# EAGLE design board1 (EAGLE 8.7.1)
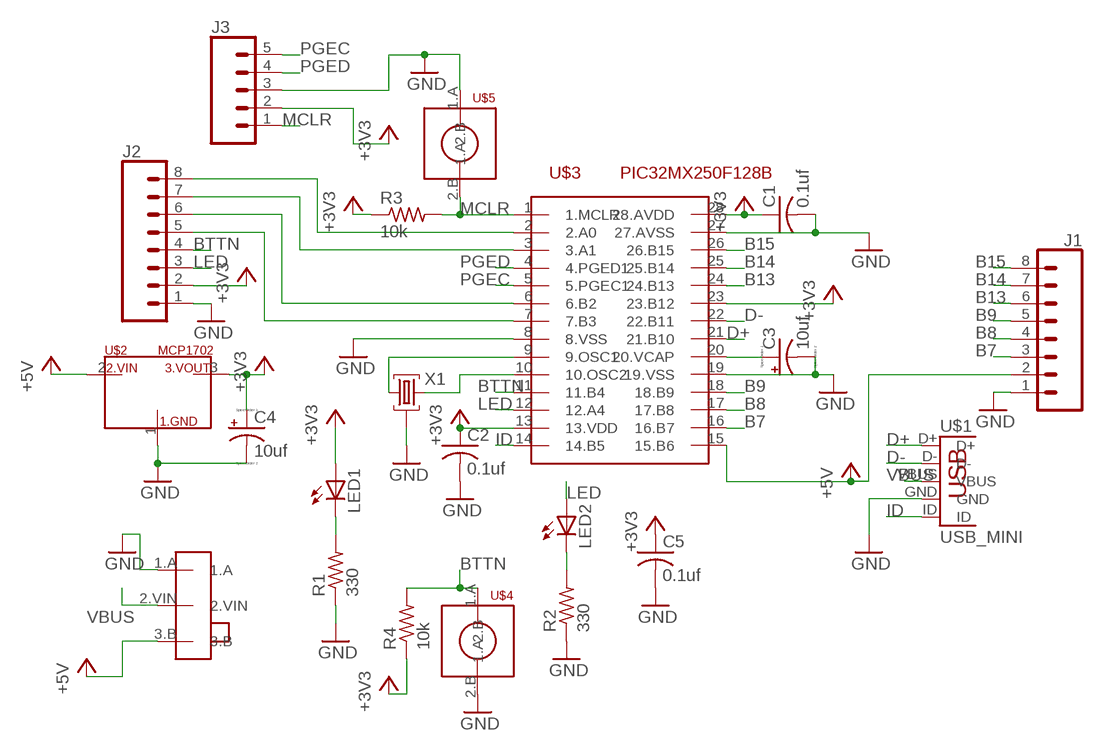
[diagram p0: schematic, sheet 1]

## Parts
C1  0.1uf  C-US025-025X050  [C025-025X050]
C2  0.1uf  C-US025-025X050  [C025-025X050]
C3  10uf  CPOL-USE2,5-6E  [E2,5-6E]
C4  10uf  CPOL-USE2,5-6E  [E2,5-6E]
C5  0.1uf  C-US025-025X050  [C025-025X050]
J1  CONN_08"  [1X08]
J2  CONN_08"  [1X08]
J3  CONN_05  [1X05]
LED1  LED5MM  [LED5MM]
LED2  LED5MM  [LED5MM]
R1  330  R-US_0204/5  [0204/5]
R2  330  R-US_0204/5  [0204/5]
R3  10k  R-US_0204/5  [0204/5]
R4  10k  R-US_0204/5  [0204/5]
U$1  USB_MINI  [USB-MB-H]
U$2  MCP1702  [TO92]
U$3  PIC32MX250F128B  [DIL28-3]
U$4  PUSH_BUTTON  [PUSH_BUTTON]
U$5  PUSH_BUTTON  [PUSH_BUTTON]
U$6  SLIDE_SWITCH  [SLIDE_SWITCH]
X1  HC49-HC49-3L  [HC49-3L]

## Nets
+3V3: C1.1 C2.1 C4.+ C5.1 J2.2 J3.2 LED1.A R3.1 R4.1 U$2.3(3.VOUT) U$3.13(13.VDD) U$3.23(23.B12) U$3.28(28.AVDD)
+5V: J1.2 U$2.2(2.VIN) U$3.15(15.B6) U$6.3.B
B7: J1.3 U$3.16(16.B7)
B8: J1.4 U$3.17(17.B8)
B9: J1.5 U$3.18(18.B9)
B13: J1.6 U$3.24(24.B13)
B14: J1.7 U$3.25(25.B14)
B15: J1.8 U$3.26(26.B15)
BTTN: J2.4 R4.2 U$3.11(11.B4) U$4.1.A
D+: U$1.D+ U$3.21(21.B10)
D-: U$1.D- U$3.22(22.B11)
GND: C1.2 C2.2 C3.- C4.- C5.2 J1.1 J2.1 J3.3 R1.1 R2.1 U$1.GND U$2.1(1.GND) U$3.8(8.VSS) U$3.19(19.VSS) U$3.27(27.AVSS) U$4.2.B U$5.1.A U$6.1.A X1.2
ID: U$1.ID U$3.14(14.B5)
LED: J2.3 LED2.A U$3.12(12.A4)
MCLR: J3.1 R3.2 U$3.1(1.MCLR) U$5.2.B
N$1: LED1.K(C) R1.2
N$2: LED2.K(C) R2.2
N$3: U$3.10(10.OSC2) X1.3
N$4: U$3.9(9.OSC1) X1.1
N$6: C3.+ U$3.20(20.VCAP)
N$11: J2.8 U$3.2(2.A0)
N$12: J2.7 U$3.3(3.A1)
N$13: J2.6 U$3.6(6.B2)
N$14: J2.5 U$3.7(7.B3)
PGEC: J3.5 U$3.5(5.PGEC1)
PGED: J3.4 U$3.4(4.PGED1)
VBUS: U$1.VBUS U$6.2.VIN

## Library data of the parts
C1 C2 C5 = me_433:C-US: CAPACITOR, American symbol
C3 C4 = me_433:CPOL-US: POLARIZED CAPACITOR, American symbol
J1 J2 = me_433:CONN_08: Multi connection point. Often used as Generic Header-pin footprint for 0.1 inch spaced/style header connections On any of the 0.1 inch spaced packages, you can populate with these: Break Away Headers - Straight <https://www.sparkfun.com/products/116> (PRT-00116) Break Away Male Headers - Right Angle <https://www.sparkfun.com/products/553> (PRT-00553) Female Headers <https://www.sparkfun.com/products/115> (PRT-00115) Break Away Headers - Machine Pin <https://www.sparkfun.com/products/117> (PRT-00117) Break Away Female Headers - Swiss Machine Pin <https://www.sparkfun.com/products/743> (PRT-00743) Arduino Stackable Header - 8 Pin <https://www.sparkfun.com/products/9279> (PRT-09279) For SCREWTERMINALS and SPRING TERMINALS visit here: Screw Terimnals on SparkFun.com <https://www.sparkfun.com/search/results?term=Screw+Terminals> (5mm/3.5mm/2.54mm spacing) This device is also useful as a general connection point to wire up your design to another part of your project. Our various solder wires solder well into these plated through hole pads. Hook-Up Wire - Assortment (Stranded, 22 AWG) <https://www.sparkfun.com/products/11375> (PRT-11375) Hook-Up Wire - Assortment (Solid Core, 22 AWG) <https://www.sparkfun.com/products/11367> (PRT-11367) View the entire wire category on our website here <https://www.sparkfun.com/categories/141> Special notes: Molex polarized connector foot print use with SKU : PRT-08231 with associated crimp pins and housings. 1MM SMD Version SKU: PRT-10208 NOTES ON THE VARIANTS LOCK and LOCK_LONGPADS... This footprint was designed to help hold the alignment of a through-hole component (i.e. 6-pin header) while soldering it into place. You may notice that each hole has been shifted either up or down by 0.005 of an inch from it's more standard position (which is a perfectly straight line). This slight alteration caused the pins (the squares in the middle) to touch the edges of the holes. Because they are alternating, it causes a "brace" to hold the component in place. 0.005 has proven to be the perfect amount of "off-center" position when using our standard breakaway headers. Although looks a little odd when you look at the bare footprint, once you have a header in there, the alteration is very hard to notice. Also,if you push a header all the way into place, it is covered up entirely on the bottom side.; PROD_ID: CONN-08438
J3 = me_433:CONN_05: Multi connection point. Often used as Generic Header-pin footprint for 0.1 inch spaced/style header connections On any of the 0.1 inch spaced packages, you can populate with these: Break Away Headers - Straight <https://www.sparkfun.com/products/116> (PRT-00116) Break Away Male Headers - Right Angle <https://www.sparkfun.com/products/553> (PRT-00553) Female Headers <https://www.sparkfun.com/products/115> (PRT-00115) Break Away Headers - Machine Pin <https://www.sparkfun.com/products/117> (PRT-00117) Break Away Female Headers - Swiss Machine Pin <https://www.sparkfun.com/products/743> (PRT-00743) For SCREWTERMINALS and SPRING TERMINALS visit here: Screw Terimnals on SparkFun.com <https://www.sparkfun.com/search/results?term=Screw+Terminals> (5mm/3.5mm/2.54mm spacing) This device is also useful as a general connection point to wire up your design to another part of your project. Our various solder wires solder well into these plated through hole pads. Hook-Up Wire - Assortment (Stranded, 22 AWG) <https://www.sparkfun.com/products/11375> (PRT-11375) Hook-Up Wire - Assortment (Solid Core, 22 AWG) <https://www.sparkfun.com/products/11367> (PRT-11367) View the entire wire category on our website here <https://www.sparkfun.com/categories/141> Special notes: Molex polarized connector foot print use with SKU : PRT-08231 with associated crimp pins and housings. 1MM SMD Version SKU: PRT-10208
LED1 LED2 = led:LED: LED OSRAM: - CHIPLED LG R971, LG N971, LY N971, LG Q971, LY Q971, LO R971, LY R971 LH N974, LH R974 LS Q976, LO Q976, LY Q976 LO Q996 - Hyper CHIPLED LW Q18S LB Q993, LB Q99A, LB R99A - SideLED LS A670, LO A670, LY A670, LG A670, LP A670 LB A673, LV A673, LT A673, LW A673 LH A674 LY A675 LS A676, LA A676, LO A676, LY A676, LW A676 LS A679, LY A679, LG A679 - Hyper Micro SIDELED® LS Y876, LA Y876, LO Y876, LY Y876 LT Y87S - SmartLED LW L88C, LW L88S LB L89C, LB L89S, LG L890 LS L89K, LO L89K, LY L89K LS L896, LA L896, LO L896, LY L896 - TOPLED LS T670, LO T670, LY T670, LG T670, LP T670 LSG T670, LSP T670, LSY T670, LOP T670, LYG T670 LG T671, LOG T671, LSG T671 LB T673, LV T673, LT T673, LW T673 LH T674 LS T676, LA T676, LO T676, LY T676, LB T676, LH T676, LSB T676, LW T676 LB T67C, LV T67C, LT T67C, LS T67K, LO T67K, LY T67K, LW E67C LS E67B, LA E67B, LO E67B, LY E67B, LB E67C, LV E67C, LT E67C LW T67C LS T679, LY T679, LG T679 LS T770, LO T770, LY T770, LG T770, LP T770 LB T773, LV T773, LT T773, LW T773 LH T774 LS E675, LA E675, LY E675, LS T675 LS T776, LA T776, LO T776, LY T776, LB T776 LHGB T686 LT T68C, LB T68C - Hyper Mini TOPLED® LB M676 - Mini TOPLED Santana® LG M470 LS M47K, LO M47K, LY M47K Source: http://www.osram.convergy.de LUXEON: - LUMILED® LXK2-PW12-R00, LXK2-PW12-S00, LXK2-PW14-U00, LXK2-PW14-V00 LXK2-PM12-R00, LXK2-PM12-S00, LXK2-PM14-U00 LXK2-PE12-Q00, LXK2-PE12-R00, LXK2-PE12-S00, LXK2-PE14-T00, LXK2-PE14-U00 LXK2-PB12-K00, LXK2-PB12-L00, LXK2-PB12-M00, LXK2-PB14-N00, LXK2-PB14-P00, LXK2-PB14-Q00 LXK2-PR12-L00, LXK2-PR12-M00, LXK2-PR14-Q00, LXK2-PR14-R00 LXK2-PD12-Q00, LXK2-PD12-R00, LXK2-PD12-S00 LXK2-PH12-R00, LXK2-PH12-S00 LXK2-PL12-P00, LXK2-PL12-Q00, LXK2-PL12-R00 Source: www.luxeon.com KINGBRIGHT: KA-3528ASYC Source: www.kingbright.com
R1-R4 = resistor:R-US_: RESISTOR, American symbol
U$1 = usb_conn:USB_MINI
U$2 = me_433:MCP1702
U$3 = me_433:PIC32MX250F128B
U$4 U$5 = me_433:PUSH_BUTTON
U$6 = me_433:SLIDE_SWITCH
X1 = me_433:HC49: Crystals; MFD: IQD Frequency Products

## Board
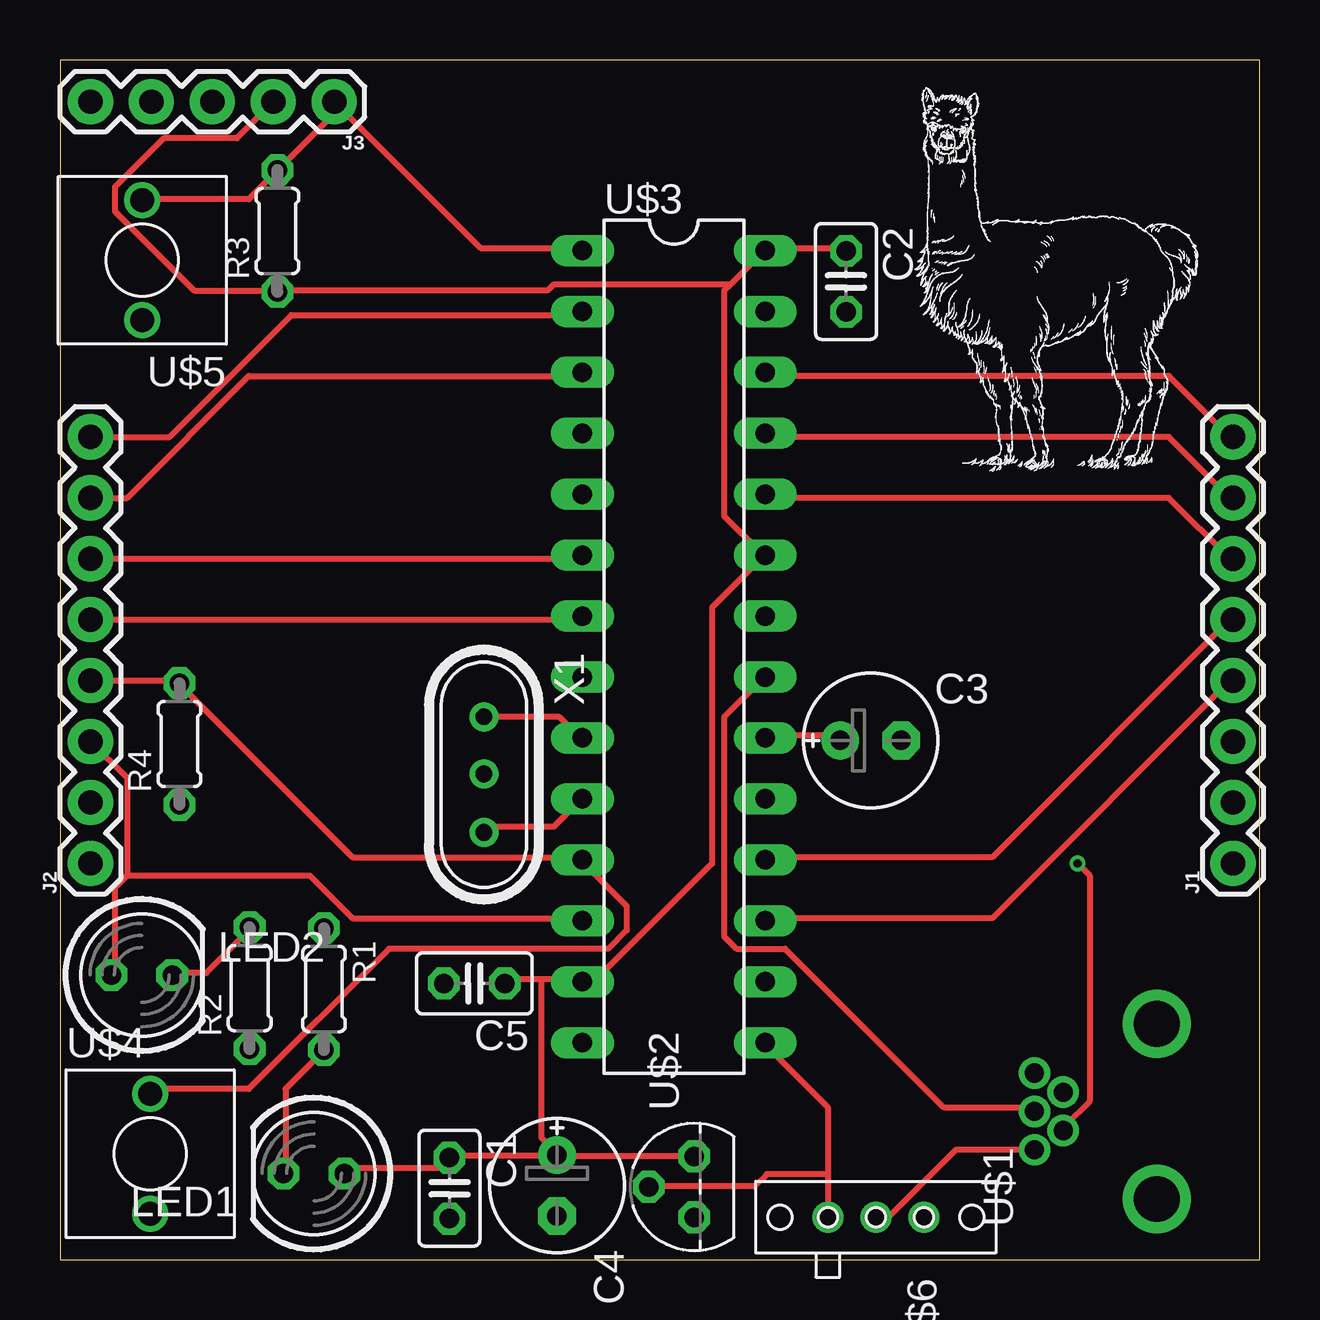
[diagram p1: board, top side]
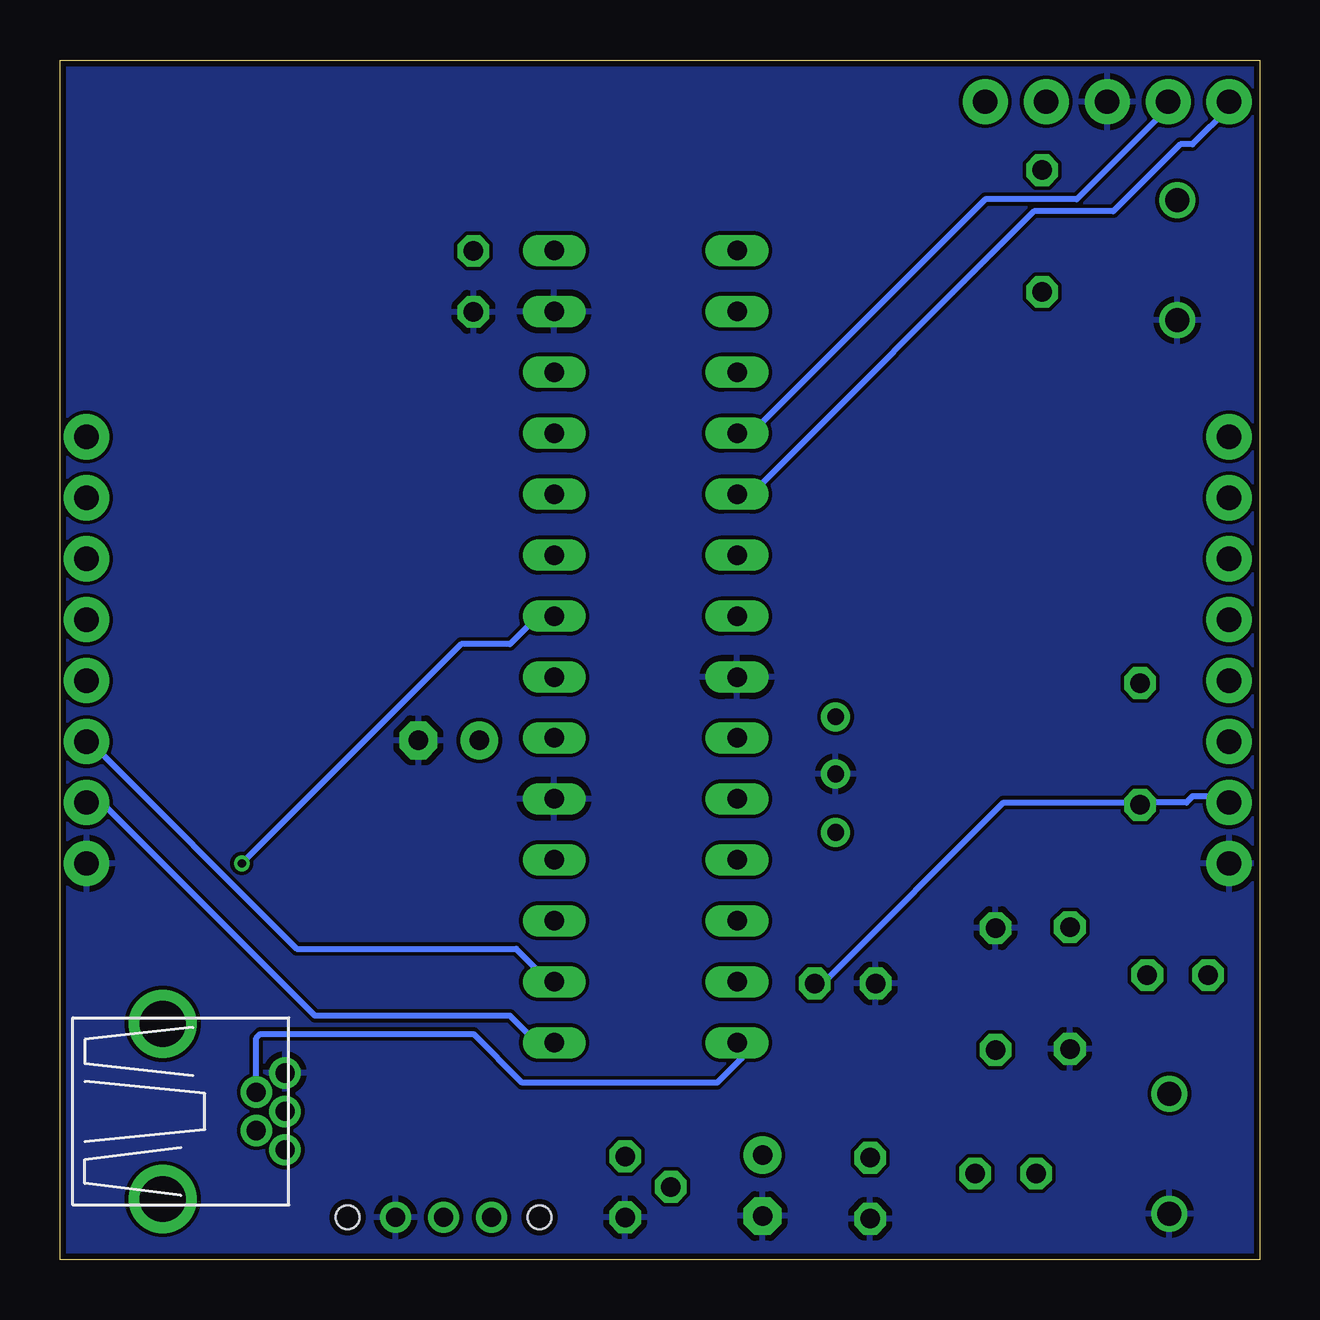
[diagram p2: board, bottom side, seen from below]

Size 50 x 50 mm. Coordinates in mm from the lower left corner, seen from the top.
Outline: 0,0 50,0 50,50 0,50 0,0
Copper layers (1*16): Top 0.035mm / dielectric 1.5mm / Bottom 0.035mm
Design rules "SeeedStudio_2layer_DRU_no_angle_20140221": minimum track width 6mil, minimum drill 12mil, track to track 6mil, track to pad 6mil, pad to pad 6mil, via to via 6mil, smd to smd 0mil, copper to edge 10mil, drill to drill 10mil, minimum pad ring 10mil, minimum via ring 6mil, stop-mask expansion 2mil, vias tented up to drill 100mil, thermal gap 10mil

### Footprints (pad centres in the part's own frame; a part is rotated, then mirrored left to right if it is on the bottom)
C025-025X050 = drill 0.813 octagon: 1 -1.27,0; 2 1.27,0
E2,5-6E = drill 0.813 pad 1.575: + -1.27,0 | drill 0.813 pad 1.575 octagon: - 1.27,0
1X08 = drill 1.016 pad 1.88: 1 0,0; 2 2.54,0; 3 5.08,0; 4 7.62,0; 5 10.16,0; 6 12.7,0; 7 15.24,0; 8 17.78,0
1X05 = drill 1.016 pad 1.88: 1 0,0; 2 2.54,0; 3 5.08,0; 4 7.62,0; 5 10.16,0
LED5MM = drill 0.813 octagon: A -1.27,0; K 1.27,0
0204/5 = drill 0.813 octagon: 1 -2.54,0; 2 2.54,0
USB-MB-H = drill 0.8: D+ 5.1,0; D- 3.9,0.8; GND 5.1,-1.6; ID 3.9,-0.8; VBUS 5.1,1.6 | drill 1.9: P$6 0,-3.65; P$7 0,3.65
TO92 = drill 0.813 octagon: 1 -1.27,0; 2 0,1.905; 3 1.27,0
DIL28-3 = drill 0.813 long: 1 -16.51,-3.81; 2 -13.97,-3.81; 3 -11.43,-3.81; 4 -8.89,-3.81; 5 -6.35,-3.81; 6 -3.81,-3.81; 7 -1.27,-3.81; 8 1.27,-3.81; 9 3.81,-3.81; 10 6.35,-3.81; 11 8.89,-3.81; 12 11.43,-3.81; 13 13.97,-3.81; 14 16.51,-3.81; 15 16.51,3.81; 16 13.97,3.81; 17 11.43,3.81; 18 8.89,3.81; 19 6.35,3.81; 20 3.81,3.81; 21 1.27,3.81; 22 -1.27,3.81; 23 -3.81,3.81; 24 -6.35,3.81; 25 -8.89,3.81; 26 -11.43,3.81; 27 -13.97,3.81; 28 -16.51,3.81
PUSH_BUTTON = drill 1: 1.A 0,2.5; 2.B 0,-2.5
SLIDE_SWITCH = drill 0.8: 1.A 0,2; 2.VIN 0,0; 3.B 0,-2 | hole 1: 0,-4; 0,4
HC49-3L = drill 0.7 pad 1.2: 1 -2.413,0; 2 -0.027,0; 3 2.413,0

### Placement (x,y rotation side)
C1  16.23,2.97 270 top
C2  32.77,40.77 270 top
C3  33.79,21.64 0 top
C4  20.72,3.08 270 top
C5  17.27,11.51 180 top
J1  48.9,16.51 90 top
J2  1.27,16.51 90 top
J3  11.43,48.26 180 top
LED1  10.59,3.58 180 top
LED2  3.41,11.86 0 top
R1  11.01,11.28 270 top
R2  7.91,11.32 90 top
R3  9.06,42.87 90 top
R4  4.98,21.49 90 top
U$1  45.72,6.17 180 top
U$2  26.44,3.03 90 top
U$3  25.59,25.55 270 top
U$4  3.76,4.41 0 top
U$5  3.43,41.66 180 top
U$6  34.01,1.76 270 top
X1  17.67,20.21 270 top

### Tracks (layer width: path | path; a pad name or v marks a point on that pad's centre or on a via)
+3V3
  Top 0.254: LED1.A 11.94,3.81 15.75,3.81 16,4.06 C1.1 16.26,4.32 20.57,4.32 C4.+ | 20.07,11.68 21.59,11.68 U$3.13 21.84,11.68 22.35,11.68 27.18,16.51 27.18,27.18 29.21,29.21 U$3.23 29.21,29.46 27.69,30.99 27.69,40.39 27.94,40.64 | 20.07,11.68 18.54,11.68 C5.1 | U$2.3 26.42,4.32 20.83,4.32 C4.+ | 20.07,11.68 20.07,5.08 20.57,4.57 C4.+ | J3.2 7.37,46.74 4.32,46.74 2.29,44.7 2.29,43.69 5.59,40.39 8.89,40.39 R3.1 9.14,40.39 20.32,40.39 20.57,40.64 27.94,40.64 | 27.94,40.64 29.21,41.91 U$3.28 29.46,42.16 32.77,42.16 C2.1
  Bottom 0.254: J2.2 1.52,19.3 2.79,19.3 3.05,19.05 4.83,19.05 R4.1 5.08,19.05 10.67,19.05 18.03,11.68 18.54,11.68 C5.1
+5V
  Top 0.254: 32,3.56 32,6.35 29.46,8.89 U$3.15 | 32,3.56 32,1.78 U$6.3.B | 32,3.56 29.46,3.56 28.96,3.05 24.64,3.05 U$2.2
  Bottom 0.254: J1.2 48.26,19.05 39.37,10.16 31.24,10.16 30.23,9.14 29.46,9.14 U$3.15
B7
  Bottom 0.254: U$3.16 29.46,11.68 29.72,11.68 30.99,12.95 40.13,12.95 48.77,21.59 J1.3
B8
  Top 0.254: U$3.17 29.46,14.22 38.86,14.22 48.77,24.13 J1.4
B9
  Top 0.254: U$3.18 29.46,16.76 38.86,16.76 48.77,26.67 J1.5
B13
  Top 0.254: U$3.24 29.46,31.75 46.23,31.75 48.77,29.21 J1.6
B14
  Top 0.254: U$3.25 29.46,34.29 46.23,34.29 48.77,31.75 J1.7
B15
  Top 0.254: U$3.26 29.46,36.83 46.23,36.83 48.77,34.29 J1.8
BTTN
  Top 0.254: J2.4 4.83,24.13 R4.2 5.08,23.88 12.19,16.76 21.59,16.76 U$3.11 21.84,16.51 23.62,14.73 23.62,13.72 22.86,12.95 13.72,12.95 7.87,7.11 3.81,7.11 U$4.1.A
D+
  Top 0.254: U$1.D+ 40.39,6.35 36.83,6.35 30.23,12.95 28.19,12.95 27.69,13.46 27.69,22.61 29.21,24.13 U$3.21
D-  (via drill 0.35)
  Top 0.254: v42.42,16.51 42.93,16 42.93,6.6 41.91,5.59 U$1.D-
  Bottom 0.254: v42.42,16.51 33.27,25.65 31.24,25.65 30.23,26.67 29.46,26.67 U$3.22
GND
  pour Bottom: 0,50 0,0 50,0 50,50
ID
  Bottom 0.254: 41.91,7.11 U$1.ID 41.82,9.24 41.66,9.4 32.77,9.4 30.73,7.37 22.61,7.37 21.59,8.38 21.59,8.89 U$3.14
LED
  Top 0.254: 2.79,16 2.29,15.49 2.29,11.94 LED2.A | 2.79,16 2.79,20.07 J2.3 | 2.79,16 10.41,16 12.19,14.22 21.59,14.22 U$3.12
MCLR
  Top 0.254: 11.68,48.01 17.53,42.16 21.59,42.16 U$3.1 | 11.68,48.01 9.14,45.47 R3.2 8.89,45.21 7.87,44.2 3.56,44.2 U$5.2.B | 11.68,48.01 J3.1
N$1
  Top 0.254: LED1.K 9.4,3.81 9.4,7.11 10.92,8.64 R1.2
N$2
  Top 0.254: LED2.K 4.83,11.94 6.1,11.94 7.87,13.72 R2.2
N$3
  Top 0.254: X1.3 17.78,18.03 20.57,18.03 21.59,19.05 U$3.10
N$4
  Top 0.254: X1.1 17.78,22.61 20.83,22.61 21.59,21.84 U$3.9
N$6
  Top 0.254: U$3.20 29.46,21.84 32.51,21.84 C3.+
N$11
  Top 0.254: J2.8 4.57,34.29 9.65,39.37 21.59,39.37 U$3.2
N$12
  Top 0.254: J2.7 2.79,31.75 7.87,36.83 21.59,36.83 U$3.3
N$13
  Top 0.254: J2.6 21.59,29.21 U$3.6
N$14
  Top 0.254: J2.5 21.59,26.67 U$3.7
PGEC
  Bottom 0.254: J3.5 1.27,48.01 2.79,46.48 3.3,46.48 6.1,43.69 9.4,43.69 21.08,32 21.59,32 U$3.5
PGED
  Bottom 0.254: J3.4 3.81,48.01 7.62,44.2 11.43,44.2 21.08,34.54 21.59,34.54 U$3.4
VBUS
  Top 0.254: U$6.2.VIN 34.04,1.78 34.54,1.78 37.34,4.57 40.39,4.57 U$1.VBUS

### Text on the board
tPlace: C:/Users/David/Documents/ME 433/HW 2/HW2/alpaca.bmp